# EAGLE design untitled (EAGLE 9.6.2)
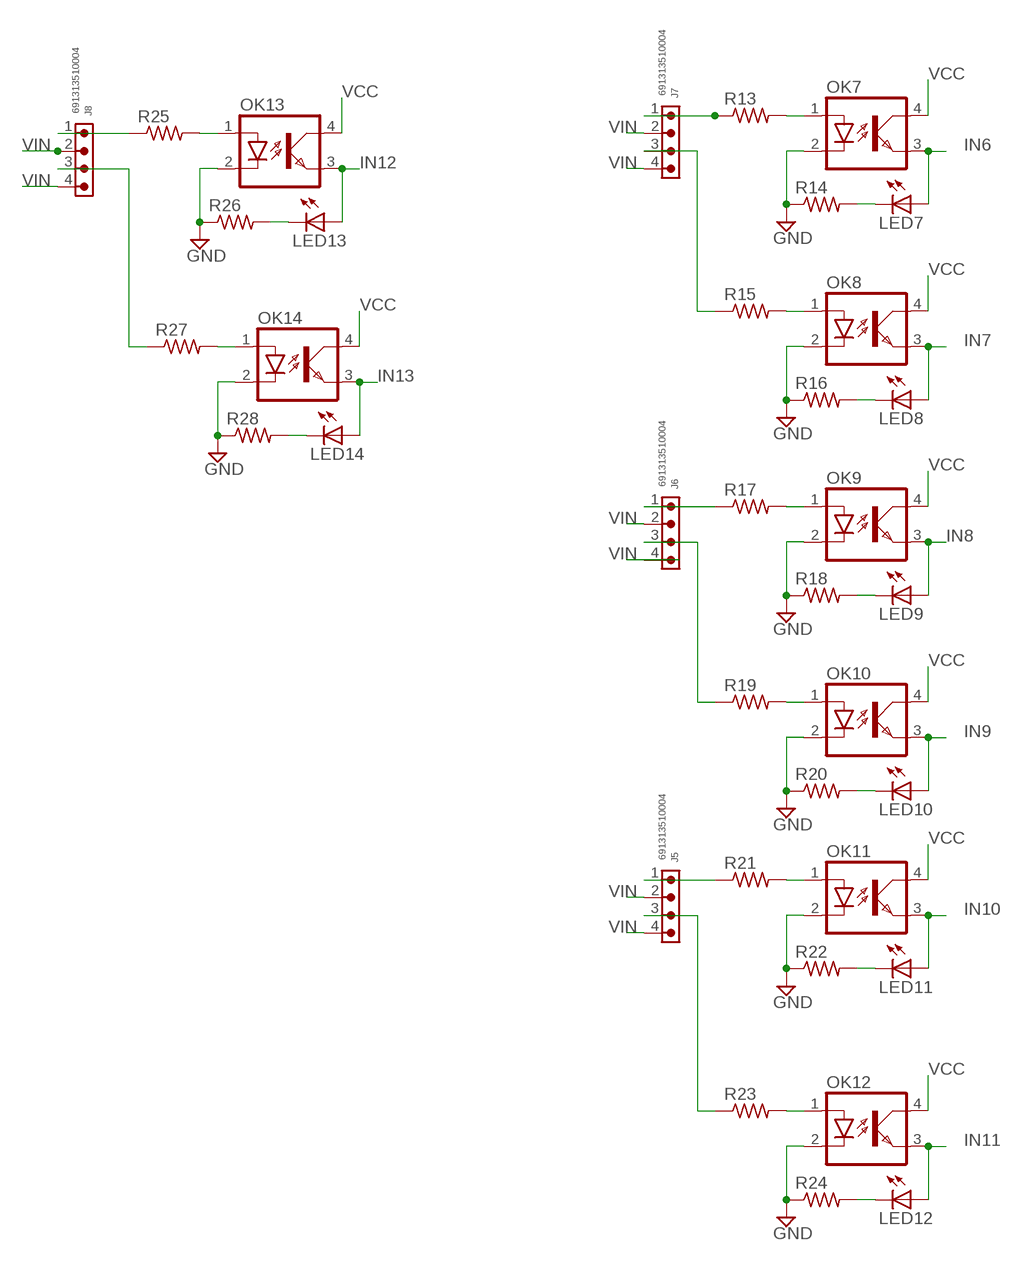
[diagram p0: schematic, sheet 1, part 1 of 2]
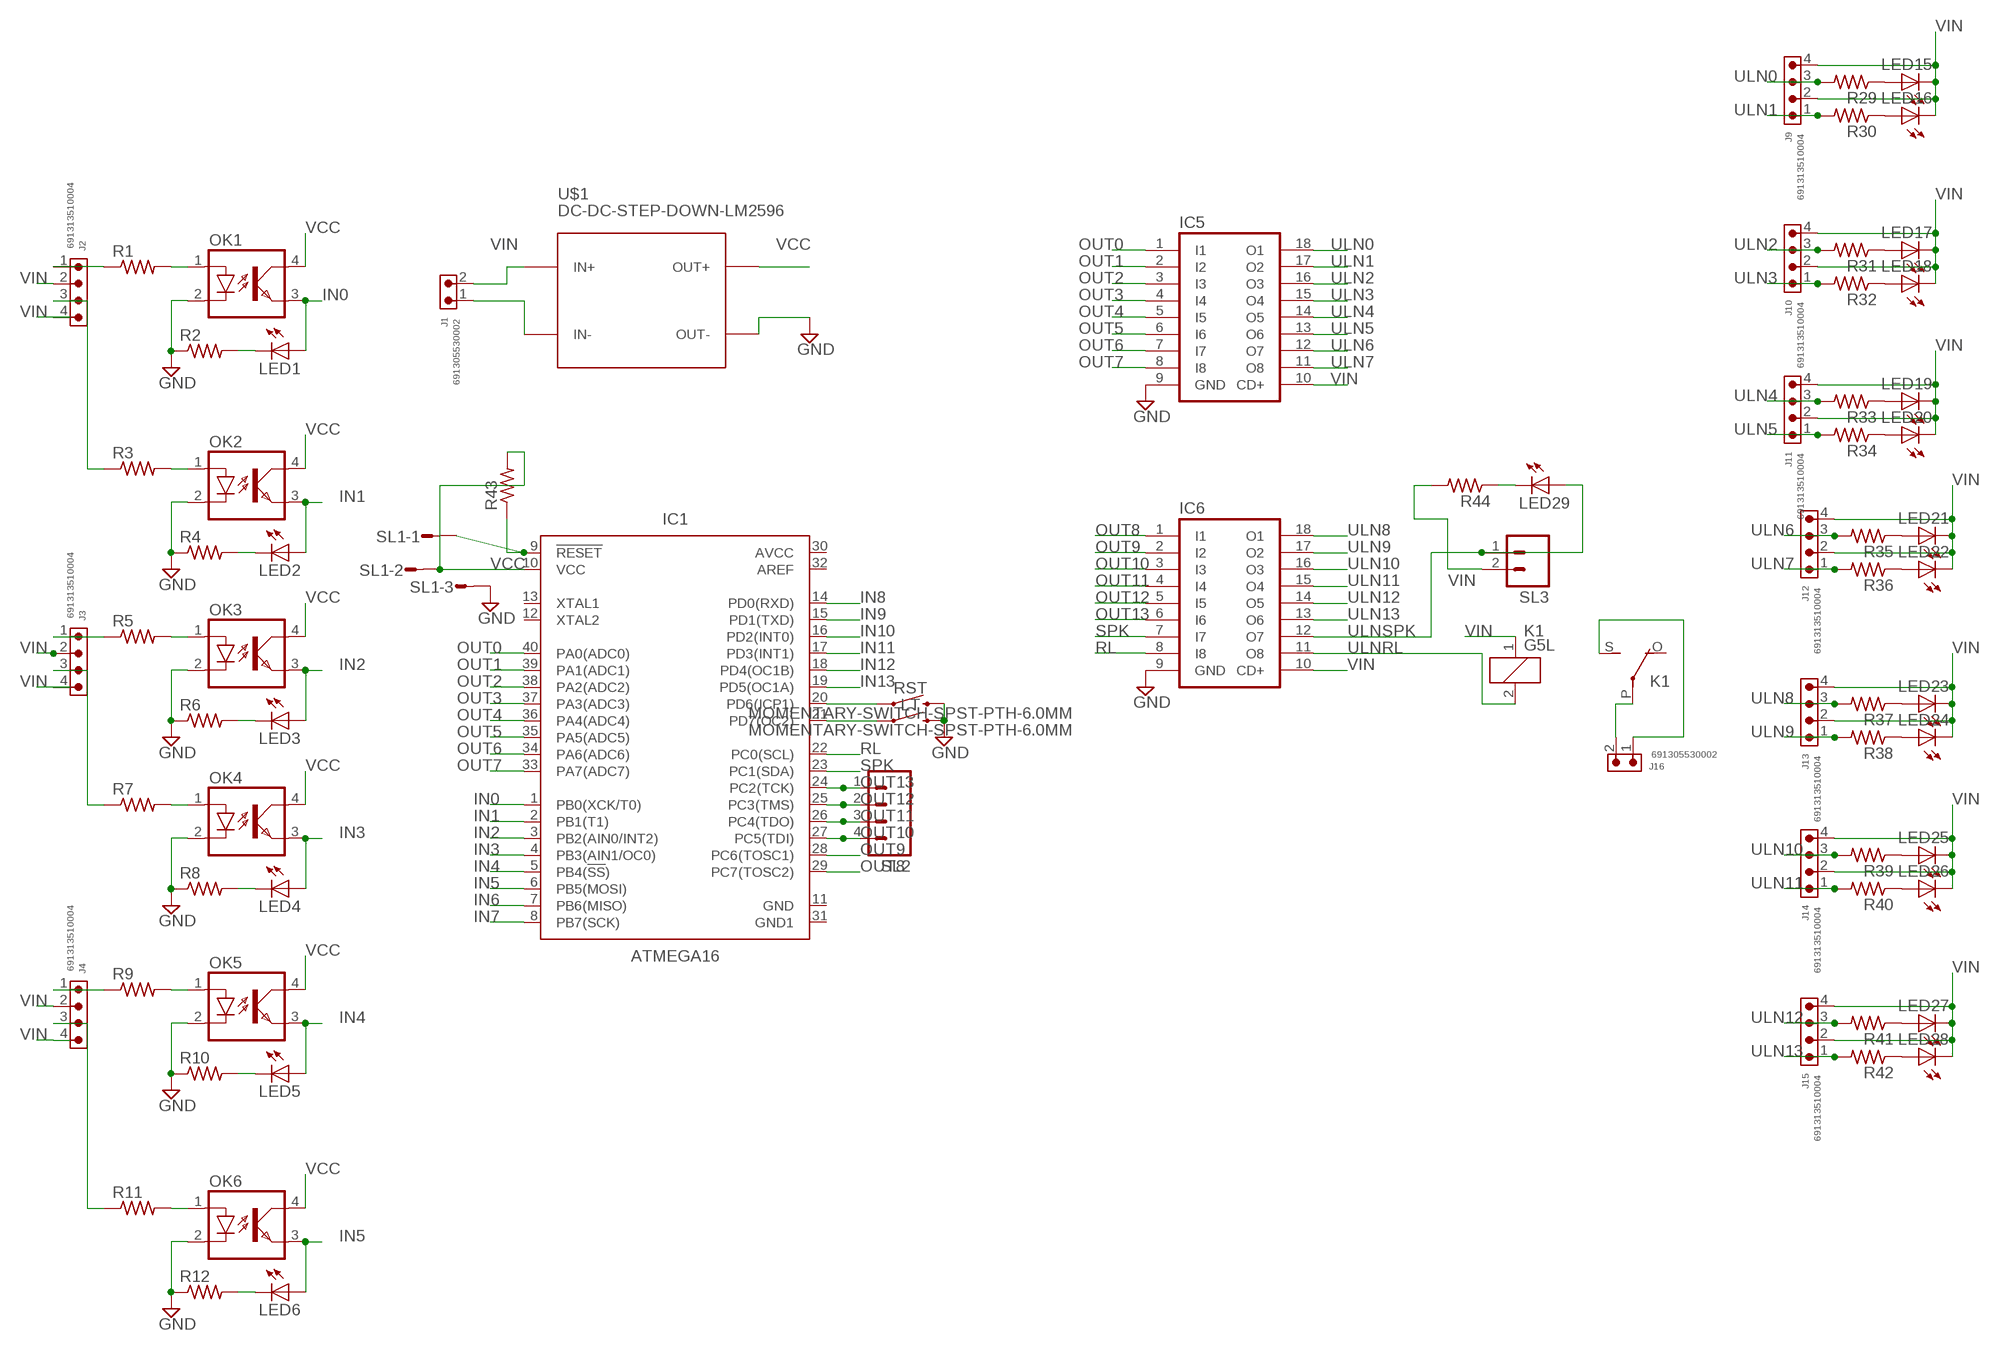
[diagram p1: schematic, sheet 1, part 2 of 2]

## Parts
IC1  ATMEGA16  ATMEGA32-16PU_DIP  [DIP1587W56P254L5229H482Q40B]
IC5  ULN2803A  [DIL18]
IC6  ULN2803A  [DIL18]
J1  691305530002  691305530002  [691305530002]
J2  691313510004  691313510004  [691313510004]
J3  691313510004  691313510004  [691313510004]
J4  691313510004  691313510004  [691313510004]
J5  691313510004  691313510004  [691313510004]
J6  691313510004  691313510004  [691313510004]
J7  691313510004  691313510004  [691313510004]
J8  691313510004  691313510004  [691313510004]
J9  691313510004  691313510004  [691313510004]
J10  691313510004  691313510004  [691313510004]
J11  691313510004  691313510004  [691313510004]
J12  691313510004  691313510004  [691313510004]
J13  691313510004  691313510004  [691313510004]
J14  691313510004  691313510004  [691313510004]
J15  691313510004  691313510004  [691313510004]
J16  691305530002  691305530002  [691305530002]
K1  G5L  [G5LE]
LED1  LED5MM  [LED5MM]
LED2  LED5MM  [LED5MM]
LED3  LED5MM  [LED5MM]
LED4  LED5MM  [LED5MM]
LED5  LED5MM  [LED5MM]
LED6  LED5MM  [LED5MM]
LED7  LED5MM  [LED5MM]
LED8  LED5MM  [LED5MM]
LED9  LED5MM  [LED5MM]
LED10  LED5MM  [LED5MM]
LED11  LED5MM  [LED5MM]
LED12  LED5MM  [LED5MM]
LED13  LED5MM  [LED5MM]
LED14  LED5MM  [LED5MM]
LED15  LED5MM  [LED5MM]
LED16  LED5MM  [LED5MM]
LED17  LED5MM  [LED5MM]
LED18  LED5MM  [LED5MM]
LED19  LED5MM  [LED5MM]
LED20  LED5MM  [LED5MM]
LED21  LED5MM  [LED5MM]
LED22  LED5MM  [LED5MM]
LED23  LED5MM  [LED5MM]
LED24  LED5MM  [LED5MM]
LED25  LED5MM  [LED5MM]
LED26  LED5MM  [LED5MM]
LED27  LED5MM  [LED5MM]
LED28  LED5MM  [LED5MM]
LED29  LED5MM  [LED5MM]
LT  MOMENTARY-SWITCH-SPST-PTH-6.0MM  [TACTILE_SWITCH_PTH_6.0MM]
OK1  PC817  [DIL04]
OK2  PC817  [DIL04]
OK3  PC817  [DIL04]
OK4  PC817  [DIL04]
OK5  PC817  [DIL04]
OK6  PC817  [DIL04]
OK7  PC817  [DIL04]
OK8  PC817  [DIL04]
OK9  PC817  [DIL04]
OK10  PC817  [DIL04]
OK11  PC817  [DIL04]
OK12  PC817  [DIL04]
OK13  PC817  [DIL04]
OK14  PC817  [DIL04]
R1  R-US_0207/7  [0207/7]
R2  R-US_0207/7  [0207/7]
R3  R-US_0207/7  [0207/7]
R4  R-US_0207/7  [0207/7]
R5  R-US_0207/7  [0207/7]
R6  R-US_0207/7  [0207/7]
R7  R-US_0207/7  [0207/7]
R8  R-US_0207/7  [0207/7]
R9  R-US_0207/7  [0207/7]
R10  R-US_0207/7  [0207/7]
R11  R-US_0207/7  [0207/7]
R12  R-US_0207/7  [0207/7]
R13  R-US_0207/7  [0207/7]
R14  R-US_0207/7  [0207/7]
R15  R-US_0207/7  [0207/7]
R16  R-US_0207/7  [0207/7]
R17  R-US_0207/7  [0207/7]
R18  R-US_0207/7  [0207/7]
R19  R-US_0207/7  [0207/7]
R20  R-US_0207/7  [0207/7]
R21  R-US_0207/7  [0207/7]
R22  R-US_0207/7  [0207/7]
R23  R-US_0207/7  [0207/7]
R24  R-US_0207/7  [0207/7]
R25  R-US_0207/7  [0207/7]
R26  R-US_0207/7  [0207/7]
R27  R-US_0207/7  [0207/7]
R28  R-US_0207/7  [0207/7]
R29  R-US_0207/7  [0207/7]
R30  R-US_0207/7  [0207/7]
R31  R-US_0207/7  [0207/7]
R32  R-US_0207/7  [0207/7]
R33  R-US_0207/7  [0207/7]
R34  R-US_0207/7  [0207/7]
R35  R-US_0207/7  [0207/7]
R36  R-US_0207/7  [0207/7]
R37  R-US_0207/7  [0207/7]
R38  R-US_0207/7  [0207/7]
R39  R-US_0207/7  [0207/7]
R40  R-US_0207/7  [0207/7]
R41  R-US_0207/7  [0207/7]
R42  R-US_0207/7  [0207/7]
R43  R-US_0207/7  [0207/7]
R44  R-US_0207/7  [0207/7]
RST  MOMENTARY-SWITCH-SPST-PTH-6.0MM  [TACTILE_SWITCH_PTH_6.0MM]
SL1  M03S  [03P]
SL2  M04  [04P]
SL3  M02  [02P]
U$1  DC-DC-STEP-DOWN-LM2596  [DC-DC-STEP-DOWN-LM2596]

## Nets
GND: IC5.9(GND) IC6.9(GND) LT.3 OK1.2(C) OK2.2(C) OK3.2(C) OK4.2(C) OK5.2(C) OK6.2(C) OK7.2(C) OK8.2(C) OK9.2(C) OK10.2(C) OK11.2(C) OK12.2(C) OK13.2(C) OK14.2(C) R2.1 R4.1 R6.1 R8.1 R10.1 R12.1 R14.1 R16.1 R18.1 R20.1 R22.1 R24.1 R26.1 R28.1 RST.3 SL1.3 U$1.OUT-
IN0: IC1.1(PB0(XCK/T0)) LED1.A OK1.3(EMIT)
IN1: IC1.2(PB1(T1)) LED2.A OK2.3(EMIT)
IN2: IC1.3(PB2(AIN0/INT2)) LED3.A OK3.3(EMIT)
IN3: IC1.4(PB3(AIN1/OC0)) LED4.A OK4.3(EMIT)
IN4: IC1.5(PB4(!SS!)) LED5.A OK5.3(EMIT)
IN5: IC1.6(PB5(MOSI)) LED6.A OK6.3(EMIT)
IN6: IC1.7(PB6(MISO)) LED7.A OK7.3(EMIT)
IN7: IC1.8(PB7(SCK)) LED8.A OK8.3(EMIT)
IN8: IC1.14(PD0(RXD)) LED9.A OK9.3(EMIT)
IN9: IC1.15(PD1(TXD)) LED10.A OK10.3(EMIT)
IN10: IC1.16(PD2(INT0)) LED11.A OK11.3(EMIT)
IN11: IC1.17(PD3(INT1)) LED12.A OK12.3(EMIT)
IN12: IC1.18(PD4(OC1B)) LED13.A OK13.3(EMIT)
IN13: IC1.19(PD5(OC1A)) LED14.A OK14.3(EMIT)
N$2: J2.1 R1.1
N$3: OK1.1(A) R1.2
N$5: IC1.9(!RESET!) R43.1 SL1.1
N$6: LED1.K(C) R2.2
N$7: J2.3 R3.1
N$8: OK2.1(A) R3.2
N$10: LED17.A R31.1
N$11: LED2.K(C) R4.2
N$12: J3.1 R5.1
N$13: OK3.1(A) R5.2
N$15: LED18.A R32.1
N$16: LED3.K(C) R6.2
N$17: J3.3 R7.1
N$18: OK4.1(A) R7.2
N$20: LED15.A R29.1
N$21: LED4.K(C) R8.2
N$22: J4.1 R9.1
N$23: OK5.1(A) R9.2
N$24: J1.1 U$1.IN-
N$25: LED19.A R33.1
N$26: LED5.K(C) R10.2
N$27: J4.3 R11.1
N$28: OK6.1(A) R11.2
N$30: LED16.A R30.1
N$31: LED6.K(C) R12.2
N$32: J7.1 R13.1
N$33: OK7.1(A) R13.2
N$35: LED20.A R34.1
N$36: LED7.K(C) R14.2
N$37: J7.3 R15.1
N$38: OK8.1(A) R15.2
N$40: LED21.A R35.1
N$41: LED8.K(C) R16.2
N$42: J6.1 R17.1
N$43: OK9.1(A) R17.2
N$45: LED22.A R36.1
N$46: LED9.K(C) R18.2
N$47: J6.3 R19.1
N$48: OK10.1(A) R19.2
N$50: LED23.A R37.1
N$51: LED10.K(C) R20.2
N$52: J5.1 R21.1
N$53: OK11.1(A) R21.2
N$55: LED24.A R38.1
N$56: LED11.K(C) R22.2
N$57: J5.3 R23.1
N$58: OK12.1(A) R23.2
N$60: LED25.A R39.1
N$61: LED12.K(C) R24.2
N$62: J8.1 R25.1
N$63: OK13.1(A) R25.2
N$65: LED26.A R40.1
N$66: LED13.K(C) R26.2
N$67: J8.3 R27.1
N$68: OK14.1(A) R27.2
N$70: LED27.A R41.1
N$71: LED14.K(C) R28.2
N$72: LED28.A R42.1
N$73: IC1.20(PD6(ICP1)) RST.1
N$74: IC1.21(PD7(OC2)) LT.1
N$75: J16.2 K1.P(2:P)
N$76: J16.1 K1.S(2:S)
N$77: LED29.K(C) R44.1
OUT0: IC1.40(PA0(ADC0)) IC5.1(I1)
OUT1: IC1.39(PA1(ADC1)) IC5.2(I2)
OUT2: IC1.38(PA2(ADC2)) IC5.3(I3)
OUT3: IC1.37(PA3(ADC3)) IC5.4(I4)
OUT4: IC1.36(PA4(ADC4)) IC5.5(I5)
OUT5: IC1.35(PA5(ADC5)) IC5.6(I6)
OUT6: IC1.34(PA6(ADC6)) IC5.7(I7)
OUT7: IC1.33(PA7(ADC7)) IC5.8(I8)
OUT8: IC1.29(PC7(TOSC2)) IC6.1(I1)
OUT9: IC1.28(PC6(TOSC1)) IC6.2(I2)
OUT10: IC1.27(PC5(TDI)) IC6.3(I3) SL2.4
OUT11: IC1.26(PC4(TDO)) IC6.4(I4) SL2.3
OUT12: IC1.25(PC3(TMS)) IC6.5(I5) SL2.2
OUT13: IC1.24(PC2(TCK)) IC6.6(I6) SL2.1
RL: IC1.22(PC0(SCL)) IC6.8(I8)
SPK: IC1.23(PC1(SDA)) IC6.7(I7)
ULN0: IC5.18(O1) J9.3 R29.2
ULN1: IC5.17(O2) J9.1 R30.2
ULN2: IC5.16(O3) J10.3 R31.2
ULN3: IC5.15(O4) J10.1 R32.2
ULN4: IC5.14(O5) J11.3 R33.2
ULN5: IC5.13(O6) J11.1 R34.2
ULN6: IC5.12(O7) J12.3 R35.2
ULN7: IC5.11(O8) J12.1 R36.2
ULN8: IC6.18(O1) J13.3 R37.2
ULN9: IC6.17(O2) J13.1 R38.2
ULN10: IC6.16(O3) J14.3 R39.2
ULN11: IC6.15(O4) J14.1 R40.2
ULN12: IC6.14(O5) J15.3 R41.2
ULN13: IC6.13(O6) J15.1 R42.2
ULNRL: IC6.11(O8) K1.2
ULNSPK: IC6.12(O7) LED29.A SL3.1
VCC: IC1.10(VCC) OK1.4(COL) OK2.4(COL) OK3.4(COL) OK4.4(COL) OK5.4(COL) OK6.4(COL) OK7.4(COL) OK8.4(COL) OK9.4(COL) OK10.4(COL) OK11.4(COL) OK12.4(COL) OK13.4(COL) OK14.4(COL) R43.2 SL1.2 U$1.OUT+
VIN: IC5.10(CD+) IC6.10(CD+) J1.2 J2.2 J2.4 J3.2 J3.4 J4.2 J4.4 J5.2 J5.4 J6.2 J6.4 J7.2 J7.4 J8.2 J8.4 J9.2 J9.4 J10.2 J10.4 J11.2 J11.4 J12.2 J12.4 J13.2 J13.4 J14.2 J14.4 J15.2 J15.4 K1.1 LED15.K(C) LED16.K(C) LED17.K(C) LED18.K(C) LED19.K(C) LED20.K(C) LED21.K(C) LED22.K(C) LED23.K(C) LED24.K(C) LED25.K(C) LED26.K(C) LED27.K(C) LED28.K(C) R44.2 SL3.2 U$1.IN+
Unconnected: IC1.12(XTAL2) IC1.13(XTAL1) IC1.32(AREF) K1.O(2:O)

## Power pins joined to a net without a drawn wire
AVCC: IC1.30(AVCC)
GND: IC1.11(GND)
GND1: IC1.31(GND1)

## Library data of the parts
IC1 = IC_Embedded:ATMEGA32*DIP: 8-bit Microcontroller with 32KBytes In-System Programmable Flash Datasheet <http://ww1.microchip.com/downloads/en/DeviceDoc/doc2503.pdf>; CATEGORY: IC_Embedded; DESCRIPTION: IC MCU 8BIT 32KB FLASH 40DIP; MANUFACTURER: Microchip Technology; MPN: ATMEGA32-16PU; OPERATING_TEMP: -40°C to 85°C; PART_STATUS: Active; SERIES: AVR® ATmega; SPEED: 16MHz; SUB-CATEGORY: Microcontroller
IC5 IC6 = uln-udn:ULN2803A: DRIVER ARRAY
J1 J16 = Wurth_Connectors_WR-TBL Pluggable Connector:691305530002: WR-TBL Serie 3055 - 5,08 mm - PCB Header Vertical Entry with Plastic Latches KIND PROPERTIES Pitch 5.08 mm MATERIAL PROPERTIES Insulator Material PA66 Insulator Flammability Rating UL94 V-0 Insulator Color Green Terminal Material Copper Alloy Terminal Plating Tin-plated surface GENERAL INFORMATION Operating Temperature -40 up to +105 °C ELECTRICAL PROPERTIES IR UL 16 A Working Voltage [UL] 300 V (AC) Withstanding Voltage [UL] 2500 V (AC) Contact Resistance [UL] 20 mΩ CERTIFICATION UL Approval E315414 <https://www.we-online.com/catalog/media/o135349v209%20Family_WR-TBL3_6913055300xx.jpg> Details see: https://www.we-online.com/catalog/en/TBL_5_08_3055_6913055300XX/ Updated by Ella Wu 2019-12-30 2019(C) Wurth Elektronik; DATASHEET-URL: https://www.we-online.com/catalog/datasheet/691305530002.pdf; IR-UL: 16A; MOUNT: THT; PART-NUMBER: 691305530002; PINS: 2; PITCH: 5.08mm; TYPE: Vertical; WORKING-VOLTAGE-UL: 300V (AC)
J2-J15 = Wurth_Connectors_WR-TBL Pluggable Connector:691313510004: WR-TBL Serie 313 - 5.08 mm Close Horizontal PCB Header KIND PROPERTIES Pitch 5.08 mm MATERIAL PROPERTIES Insulator Material PA66 Insulator Flammability Rating UL94 V-0 Insulator Color Green Contact Material Brass Contact Plating Tin GENERAL INFORMATION Operating Temperature -40 up to +105 °C ELECTRICAL PROPERTIES IR cULus 20 A IR VDE 20 A Working Voltage [cULus] 300 V (AC) Working Voltage [VDE] 300 V (AC) Withstanding Voltage [cULus] 1600 V (AC) Withstanding Voltage [VDE] 2500 V (AC) Contact Resistance [cULus] 20 mΩ Contact Resistance [VDE] 20 mΩ CERTIFICATION cULus Approval E315414 VDE Approval 40023195 [Model number 313] <https://www.we-online.com/catalog/media/o33265v209%20Family_WR-TBL_6913135100xx.jpg> https://www.we-online.com/catalog/en/TBL_5_08_313_CLOSE_HORIZONTAL_PCB_HEADER_6913135100XX/ Updated by Ella Wu 2019-12-26 2019(C) Wurth Elektronik; DATASHEET-URL: https://www.we-online.com/catalog/datasheet/691313510004.pdf; IR-UL: 20A; IR-VDE: 20A; MOUNT: THT; PART-NUMBER: 691313510004; PINS: 4; PITCH: 5.08mm; TYPE: Horizontal; WORKING-VOLTAGE-UL: 300V (AC); WORKING-VOLTAGE-VDE: 300V (AC)
K1 = relay:G5L: RELAY 1 x switch, 10 A/120 V AC, 8 A/30 V ADC, Omron; OC_FARNELL: unknown; OC_NEWARK: unknown
LED1-LED29 = adafruit:LED: LED OSRAM: - CHIPLED LG R971, LG N971, LY N971, LG Q971, LY Q971, LO R971, LY R971 LH N974, LH R974 LS Q976, LO Q976, LY Q976 LO Q996 - Hyper CHIPLED LW Q18S LB Q993, LB Q99A, LB R99A - SideLED LS A670, LO A670, LY A670, LG A670, LP A670 LB A673, LV A673, LT A673, LW A673 LH A674 LY A675 LS A676, LA A676, LO A676, LY A676, LW A676 LS A679, LY A679, LG A679 - Hyper Micro SIDELED® LS Y876, LA Y876, LO Y876, LY Y876 LT Y87S - SmartLED LW L88C, LW L88S LB L89C, LB L89S, LG L890 LS L89K, LO L89K, LY L89K LS L896, LA L896, LO L896, LY L896 - TOPLED LS T670, LO T670, LY T670, LG T670, LP T670 LSG T670, LSP T670, LSY T670, LOP T670, LYG T670 LG T671, LOG T671, LSG T671 LB T673, LV T673, LT T673, LW T673 LH T674 LS T676, LA T676, LO T676, LY T676, LB T676, LH T676, LSB T676, LW T676 LB T67C, LV T67C, LT T67C, LS T67K, LO T67K, LY T67K, LW E67C LS E67B, LA E67B, LO E67B, LY E67B, LB E67C, LV E67C, LT E67C LW T67C LS T679, LY T679, LG T679 LS T770, LO T770, LY T770, LG T770, LP T770 LB T773, LV T773, LT T773, LW T773 LH T774 LS E675, LA E675, LY E675, LS T675 LS T776, LA T776, LO T776, LY T776, LB T776 LHGB T686 LT T68C, LB T68C - Hyper Mini TOPLED® LB M676 - Mini TOPLED Santana® LG M470 LS M47K, LO M47K, LY M47K Source: http://www.osram.convergy.de/
LT RST = SparkFun-Switches:MOMENTARY-SWITCH-SPST: Momentary Switch (Pushbutton) - SPST Normally-open (NO) SPST momentary switches (buttons, pushbuttons). Variants PTH-12MM - 12mm square, through-hole Momentary Pushbutton Switch - 12mm Square <https://www.sparkfun.com/products/9190> (COM-09190) PTH-6.0MM, PTH-6.0MM-KIT - 6.0mm square, through-hole Mini Pushbutton Switch <https://www.sparkfun.com/products/97> (COM-00097) KIT package intended for soldering kit's - only one side of pads' copper is exposed. PTH-RIGHT-ANGLE-KIT - Right-angle, through-hole Right Angle Tactile Button <https://www.sparkfun.com/products/10791> - Used on SparkFun BigTime Watch Kit <https://www.sparkfun.com/products/11734> SMD-12MM - 12mm square, surface-mount Tactile Button - SMD (12mm) <https://www.sparkfun.com/products/12993> (COM-12993) Used on SparkFun PicoBoard <https://www.sparkfun.com/products/11888> SMD-4.5MM - 4.5mm Square Trackball Switch Used on SparkFun Blackberry Trackballer Breakout <https://www.sparkfun.com/products/13169> SMD-4.6MMX2.8MM - 4.60mm x 2.80mm, surface mount Used on SparkFun SAMD21 Mini Breakout <https://www.sparkfun.com/products/13664> SMD-5.2MM, SMD-5.2-REDUNDANT - 5.2mm square, surface-mount Mini Pushbutton Switch - SMD <https://www.sparkfun.com/products/8720> (COM-08720) Used on Arduino Pro Mini <https://www.sparkfun.com/products/11114> REDUNDANT package connects both switch circuits together SMD-6.0X3.5MM - 6.0 x 3.5mm, surface mount Momentary Reset Switch SMD <https://www.sparkfun.com/products/8229> (COM-08229) SMD-6.2MM-TALL - 6.2mm square, surface mount Tactile Button - SMD (6mm) <https://www.sparkfun.com/products/12992> Used on SparkFun Digital Sandbox <https://www.sparkfun.com/products/12651> SMD-RIGHT-ANGLE - Right-angle, surface mount Used on SparkFun Block for Intel® Edison - Arduino <https://www.sparkfun.com/products/13036>; PROD_ID: SWCH-08441; SF_SKU: COM-00097
OK1-OK14 = optocoupler:PC817: SHARP OPTO COUPLER; MPN: PC817X4J000F; OC_FARNELL: 9707727; OC_NEWARK: 97K7059
R1-R44 = adafruit:R-US_: RESISTOR, American symbol
SL1 = con-amp-quick:M03S: AMP QUICK CONNECTOR; OC_FARNELL: unknown; OC_NEWARK: unknown
SL2 = con-amp-quick:M04: AMP QUICK CONNECTOR; OC_FARNELL: unknown; OC_NEWARK: unknown
SL3 = con-amp-quick:M02: AMP QUICK CONNECTOR; OC_FARNELL: unknown; OC_NEWARK: unknown
U$1 = diy-modules:DC-DC-STEP-DOWN-LM2596: DC/DC Step-Down Regulator based on LM2596-ADJ chip LM2596 datasheet available here: http://www.ti.com/lit/ds/symlink/lm2596.pdf Click here to find device on ebay.com <http://www.ebay.com/sch/lm2596+power+regulator>

## Board
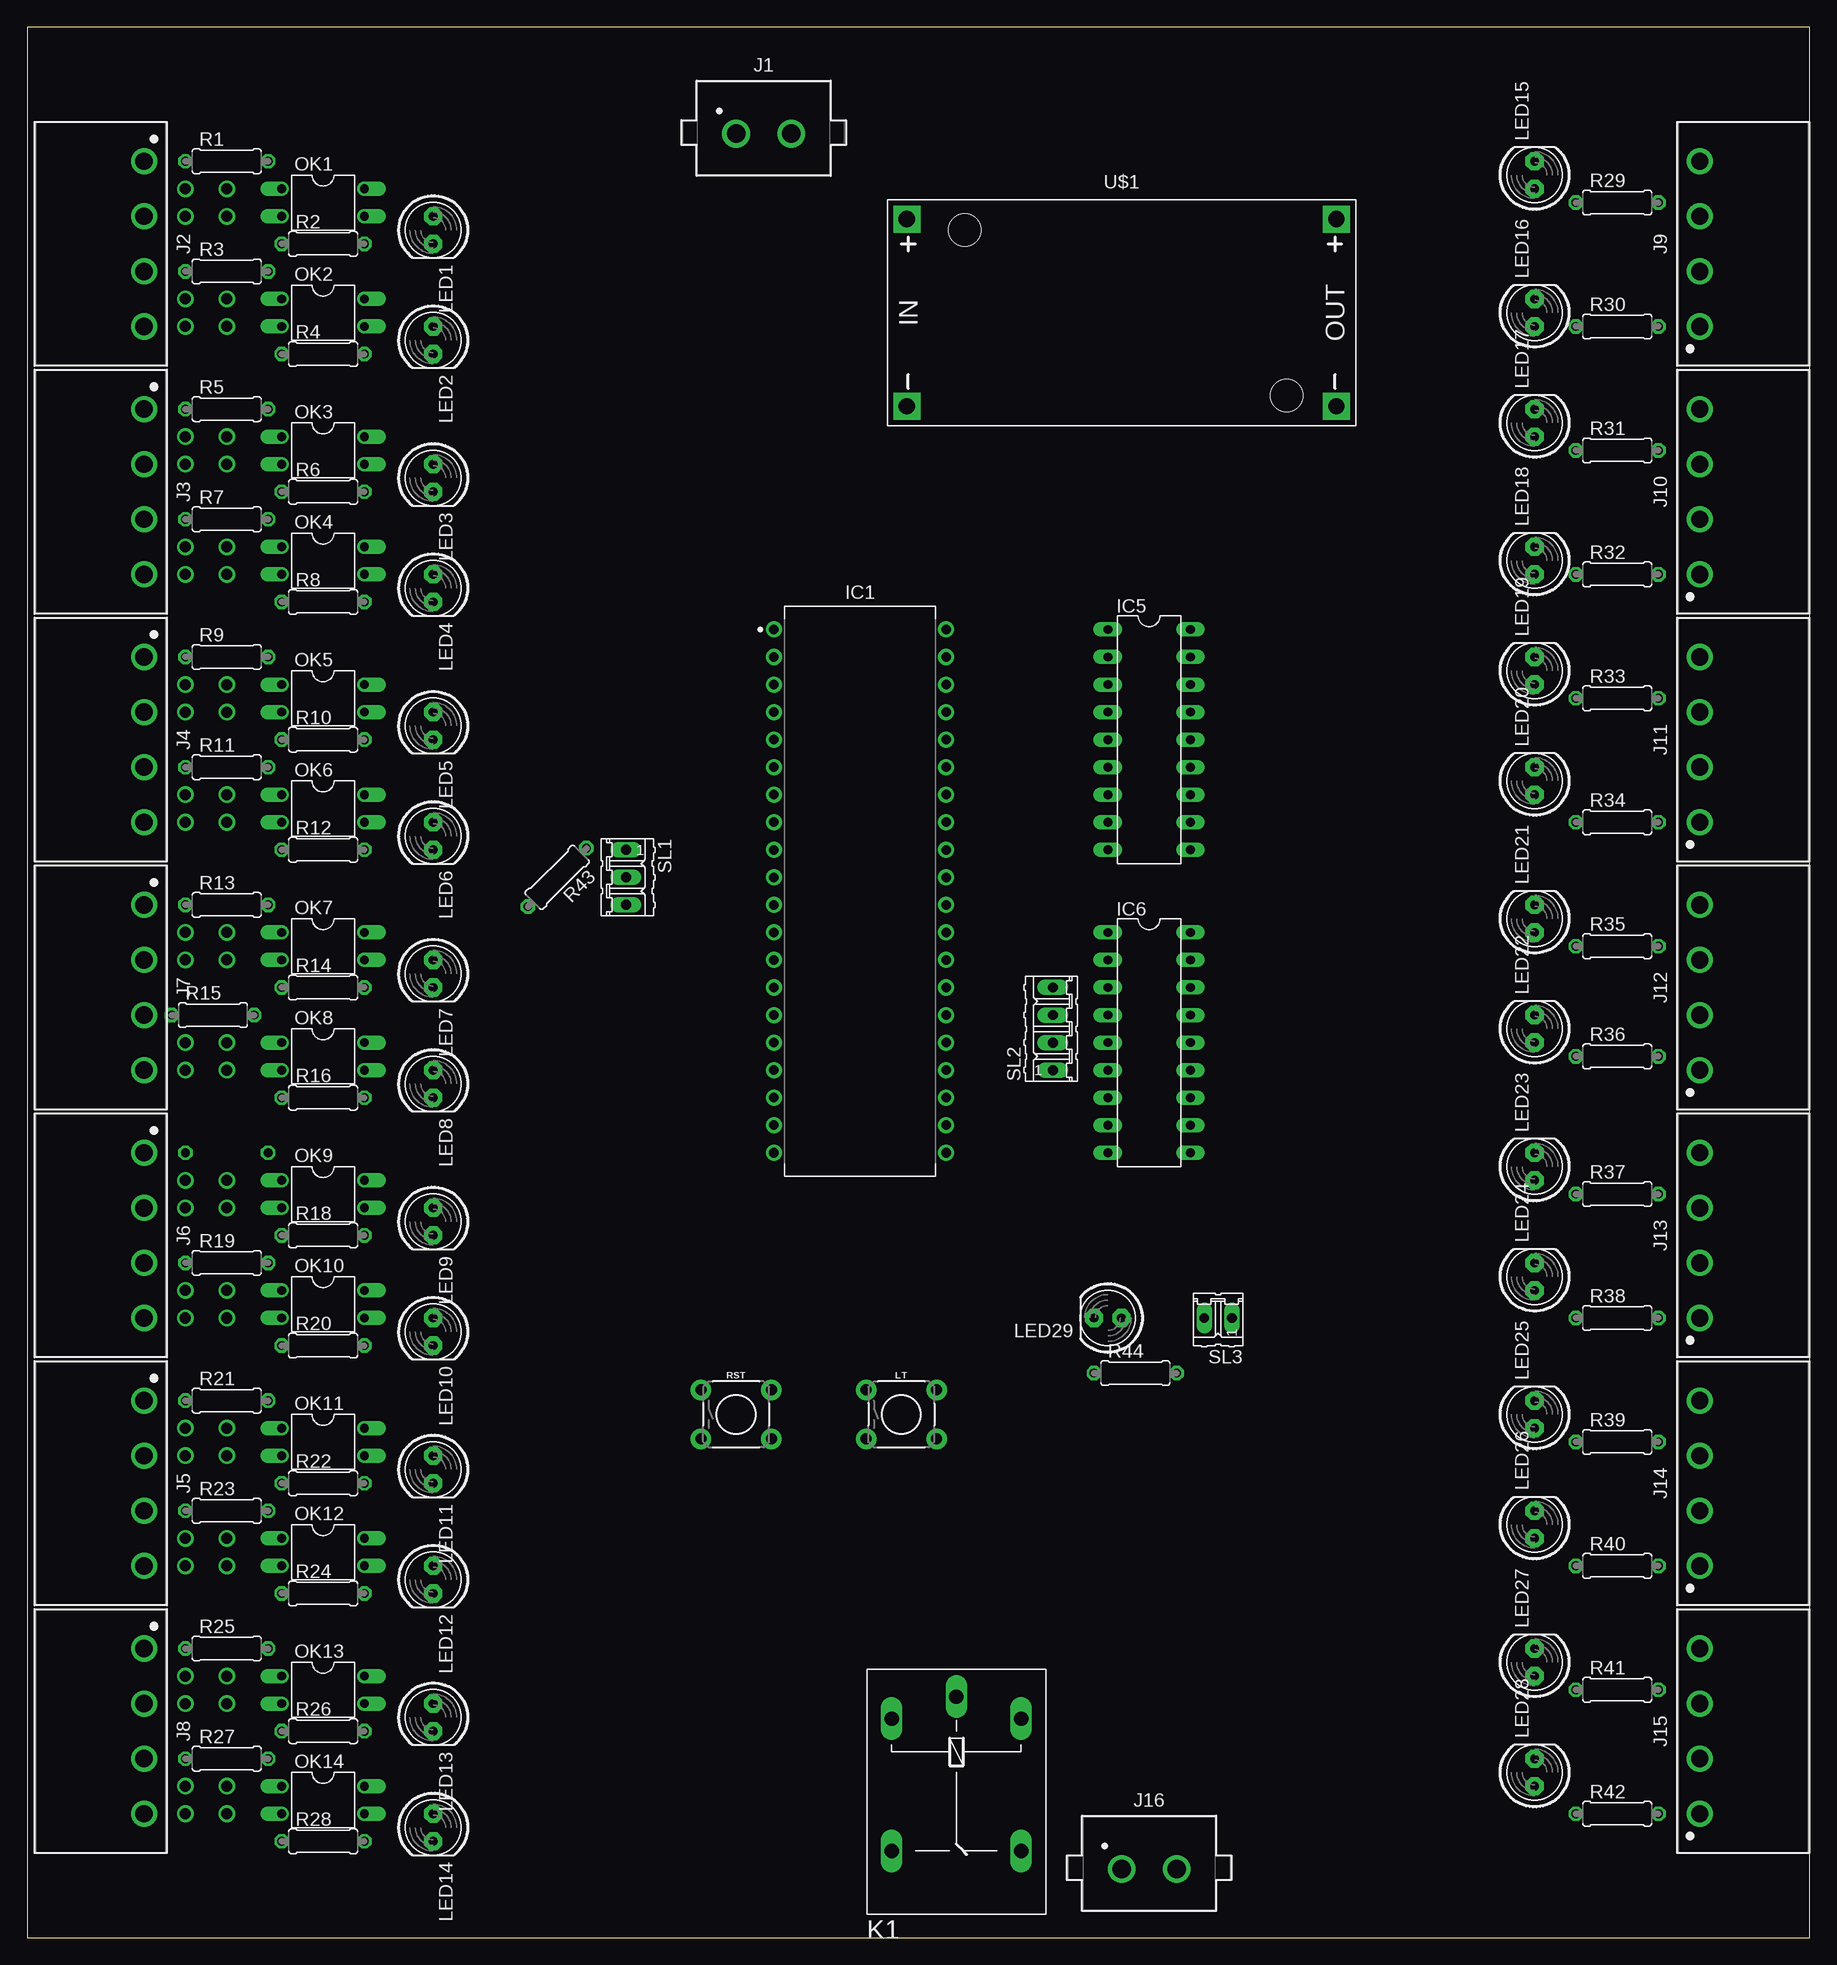
[diagram p2: board, top side]
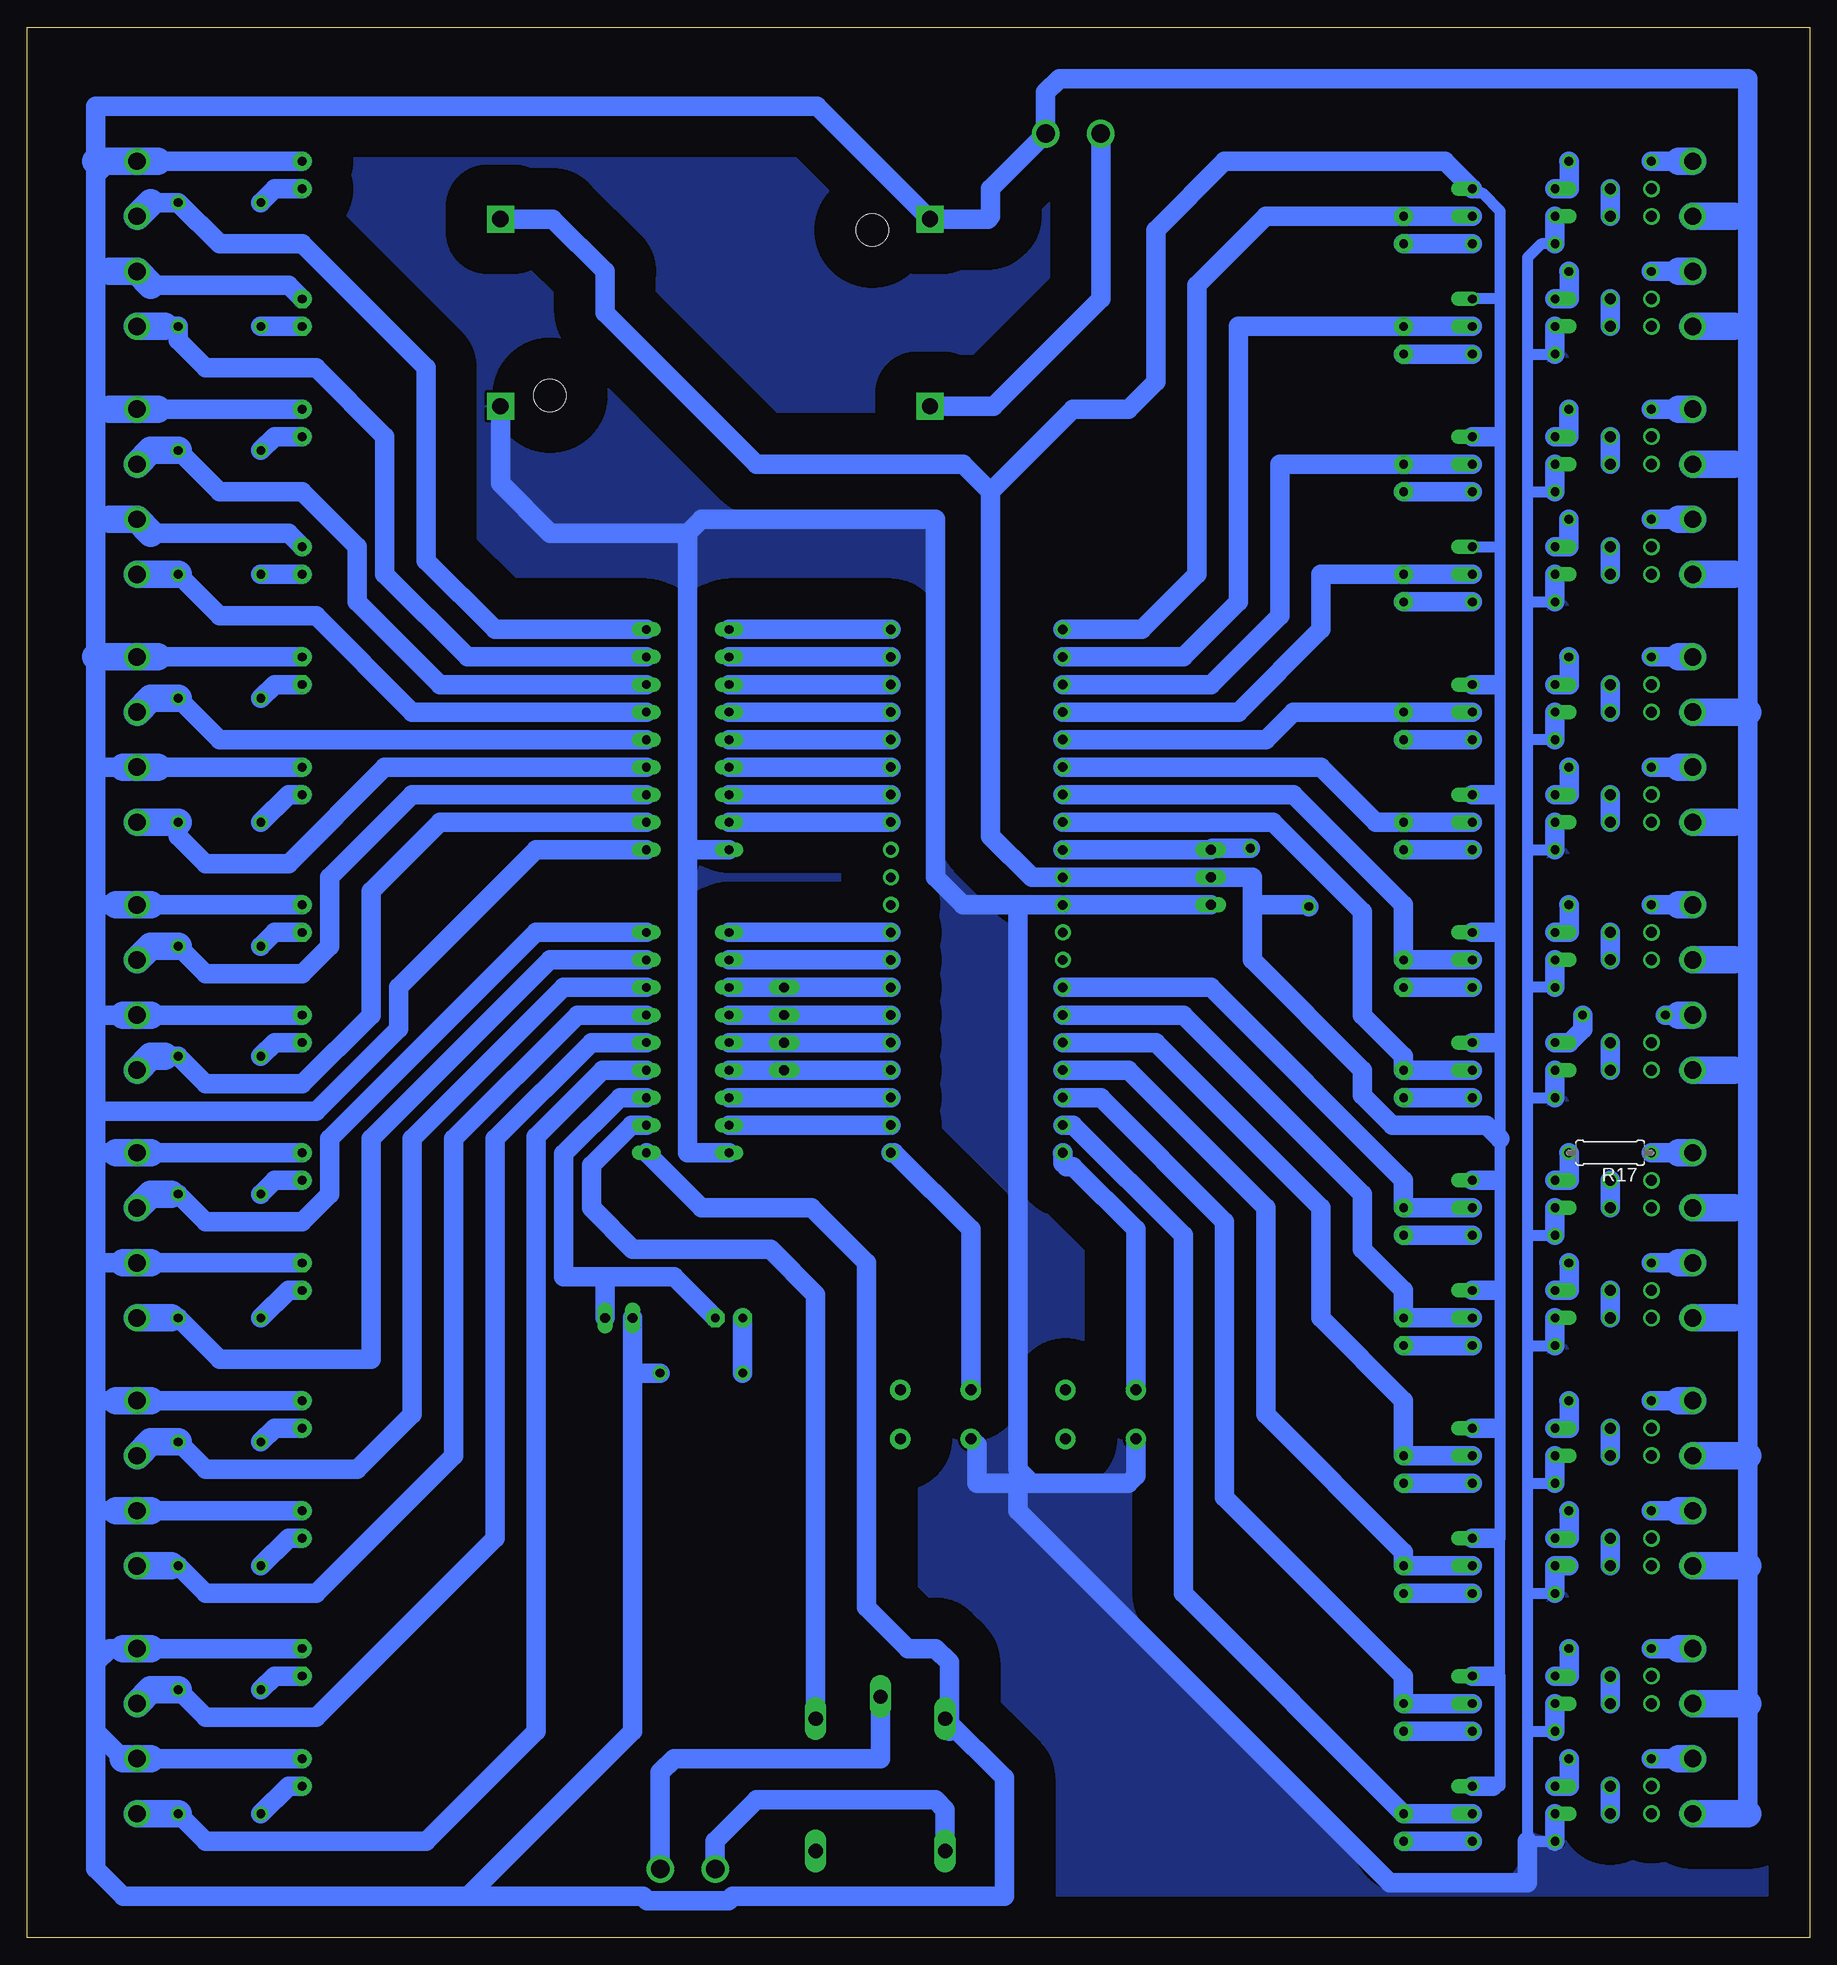
[diagram p3: board, bottom side, seen from below]

Size 164.44 x 176.2 mm. Coordinates in mm from the lower left corner, seen from the top.
Outline: 0,0 164.44,0 164.44,176.2 0,176.2 0,0
Copper layers (1*16): Top 0.035mm / dielectric 1.5mm / Bottom 0.035mm
Design rules "default *": minimum track width 70mil, minimum drill 0.35mm, track to track 30mil, track to pad 30mil, pad to pad 30mil, via to via 30mil, smd to smd 6mil, copper to edge 40mil, drill to drill 6mil, minimum pad ring 10mil, minimum via ring 8mil, stop-mask expansion 4mil, vias tented up to drill 0mil, thermal gap 10mil

### Footprints (pad centres in the part's own frame; a part is rotated, then mirrored left to right if it is on the bottom)
DIP1587W56P254L5229H482Q40B = drill 0.877 pad 1.477: 1 -7.938,24.13; 2 -7.938,21.59; 3 -7.938,19.05; 4 -7.938,16.51; 5 -7.938,13.97; 6 -7.938,11.43; 7 -7.938,8.89; 8 -7.938,6.35; 9 -7.938,3.81; 10 -7.938,1.27; 11 -7.938,-1.27; 12 -7.938,-3.81; 13 -7.938,-6.35; 14 -7.938,-8.89; 15 -7.938,-11.43; 16 -7.938,-13.97; 17 -7.938,-16.51; 18 -7.938,-19.05; 19 -7.938,-21.59; 20 -7.938,-24.13; 21 7.938,-24.13; 22 7.938,-21.59; 23 7.938,-19.05; 24 7.938,-16.51; 25 7.938,-13.97; 26 7.938,-11.43; 27 7.938,-8.89; 28 7.938,-6.35; 29 7.938,-3.81; 30 7.938,-1.27; 31 7.938,1.27; 32 7.938,3.81; 33 7.938,6.35; 34 7.938,8.89; 35 7.938,11.43; 36 7.938,13.97; 37 7.938,16.51; 38 7.938,19.05; 39 7.938,21.59; 40 7.938,24.13
DIL18 = drill 0.813 long: 1 -10.16,-3.81; 2 -7.62,-3.81; 3 -5.08,-3.81; 4 -2.54,-3.81; 5 0,-3.81; 6 2.54,-3.81; 7 5.08,-3.81; 8 7.62,-3.81; 9 10.16,-3.81; 10 10.16,3.81; 11 7.62,3.81; 12 5.08,3.81; 13 2.54,3.81; 14 0,3.81; 15 -2.54,3.81; 16 -5.08,3.81; 17 -7.62,3.81; 18 -10.16,3.81
691305530002 = drill 1.7: 1 -2.54,0; 2 2.54,0
691313510004 = drill 1.6: 1 -7.62,0; 2 -2.54,0; 3 2.54,0; 4 7.62,0
G5LE = drill 1.321 long: 1 -7.493,-5.969; 2 -7.493,5.969; O 4.699,5.969; P -9.525,0; S 4.699,-5.969
LED5MM = drill 0.813 pad 1.676 octagon: A -1.27,0; K 1.27,0
TACTILE_SWITCH_PTH_6.0MM = drill 1.016 pad 1.88: 1 -3.251,2.261; 2 3.251,2.261; 3 -3.251,-2.261; 4 3.251,-2.261
DIL04 = drill 0.813 offset: 1 -1.27,-3.81; 2 1.27,-3.81; 3 1.27,3.81; 4 -1.27,3.81
0207/7 = drill 0.813 octagon: 1 -3.81,0; 2 3.81,0
03P = drill 0.914 long: 1 -2.54,0; 2 0,0; 3 2.54,0
04P = drill 0.914 long: 1 -3.81,0; 2 -1.27,0; 3 1.27,0; 4 3.81,0
02P = drill 0.914 long: 1 -1.27,0; 2 1.27,0
DC-DC-STEP-DOWN-LM2596 = drill 1.5 pad 2.5 square: IN+ -19.812,8.636; IN- -19.812,-8.636; OUT+ 19.812,8.636; OUT- 19.812,-8.636 | hole 3: -14.478,7.62; 15.24,-7.62

### Placement (x,y rotation side)
IC1  76.84,96.52 0 top
IC5  103.5,110.49 270 top
IC6  103.5,82.55 270 top
J1  67.94,166.37 0 top
J2  10.79,156.21 270 top
J3  10.79,133.35 270 top
J4  10.79,110.49 270 top
J5  10.79,41.91 270 top
J6  10.79,64.77 270 top
J7  10.79,87.63 270 top
J8  10.79,19.05 270 top
J9  154.31,156.21 90 top
J10  154.31,133.35 90 top
J11  154.31,110.49 90 top
J12  154.31,87.63 90 top
J13  154.31,64.77 90 top
J14  154.31,41.91 90 top
J15  154.31,19.05 90 top
J16  103.5,6.35 0 top
K1  85.72,12.7 270 top
LED1  37.47,157.48 270 top
LED2  37.47,147.32 270 top
LED3  37.47,134.62 270 top
LED4  37.47,124.46 270 top
LED5  37.47,111.76 270 top
LED6  37.47,101.6 270 top
LED7  37.47,88.9 270 top
LED8  37.47,78.74 270 top
LED9  37.47,66.04 270 top
LED10  37.47,55.88 270 top
LED11  37.47,43.18 270 top
LED12  37.47,33.02 270 top
LED13  37.47,20.32 270 top
LED14  37.47,10.16 270 top
LED15  139.06,162.56 90 top
LED16  139.06,149.86 90 top
LED17  139.06,139.7 90 top
LED18  139.06,127 90 top
LED19  139.06,116.84 90 top
LED20  139.06,106.68 90 top
LED21  139.06,93.98 90 top
LED22  139.06,83.82 90 top
LED23  139.06,71.12 90 top
LED24  139.06,60.96 90 top
LED25  139.06,48.26 90 top
LED26  139.06,38.1 90 top
LED27  139.06,25.4 90 top
LED28  139.06,15.24 90 top
LED29  99.69,57.15 180 top
LT  80.65,48.26 0 top
OK1  27.3,160.02 270 top
OK2  27.3,149.86 270 top
OK3  27.3,137.16 270 top
OK4  27.3,127 270 top
OK5  27.3,114.3 270 top
OK6  27.3,104.14 270 top
OK7  27.3,91.44 270 top
OK8  27.3,81.28 270 top
OK9  27.3,68.58 270 top
OK10  27.3,58.42 270 top
OK11  27.3,45.72 270 top
OK12  27.3,35.56 270 top
OK13  27.3,22.86 270 top
OK14  27.3,12.7 270 top
R1  18.41,163.83 0 top
R2  27.3,156.21 0 top
R3  18.41,153.67 0 top
R4  27.3,146.05 0 top
R5  18.41,140.97 0 top
R6  27.3,133.35 0 top
R7  18.41,130.81 0 top
R8  27.3,123.19 0 top
R9  18.41,118.11 0 top
R10  27.3,110.49 0 top
R11  18.41,107.95 0 top
R12  27.3,100.33 0 top
R13  18.41,95.25 0 top
R14  27.3,87.63 0 top
R15  17.14,85.09 0 top
R16  27.3,77.47 0 top
R17  18.41,72.39 180 bottom
R18  27.3,64.77 0 top
R19  18.41,62.23 0 top
R20  27.3,54.61 0 top
R21  18.41,49.53 0 top
R22  27.3,41.91 0 top
R23  18.41,39.37 0 top
R24  27.3,31.75 0 top
R25  18.41,26.67 0 top
R26  27.3,19.05 0 top
R27  18.41,16.51 0 top
R28  27.3,8.89 0 top
R29  146.69,160.02 0 top
R30  146.69,148.59 0 top
R31  146.69,137.16 0 top
R32  146.69,125.73 0 top
R33  146.69,114.3 0 top
R34  146.69,102.87 0 top
R35  146.69,91.44 0 top
R36  146.69,81.28 0 top
R37  146.69,68.58 0 top
R38  146.69,57.15 0 top
R39  146.69,45.72 0 top
R40  146.69,34.29 0 top
R41  146.69,22.86 0 top
R42  146.69,11.43 0 top
R43  48.9,97.79 225 top
R44  102.24,52.07 0 top
RST  65.41,48.26 0 top
SL1  55.24,97.79 270 top
SL2  94.62,83.82 90 top
SL3  109.85,57.15 180 top
U$1  100.97,149.86 0 top

### Tracks (layer width: path | path; a pad name or v marks a point on that pad's centre or on a via)
GND
  Bottom 1.016: R2.1 24.77,156.21 26.04,154.94 26.04,146.05 | 26.04,146.05 R4.1 | 26.04,146.05 26.04,133.35 | 26.04,133.35 R6.1 | 26.04,133.35 26.04,123.19 | 26.04,123.19 R8.1 | 26.04,123.19 26.04,110.49 | R10.1 26.04,110.49 | 26.04,110.49 26.04,100.33 | 26.04,100.33 R12.1 | 26.04,100.33 26.04,87.63 | R14.1 26.04,87.63 | 26.04,87.63 26.04,77.47 | 26.04,77.47 R16.1 | 26.04,77.47 26.04,64.77 | 26.04,64.77 R18.1 | 26.04,64.77 26.04,54.61 | 26.04,54.61 R20.1 | 26.04,54.61 26.04,41.91 | 26.04,41.91 R22.1 | 26.04,41.91 26.04,31.75 | 26.04,31.75 R24.1 | 26.04,31.75 26.04,19.05 | 26.04,19.05 R26.1 | 26.04,19.05 26.04,8.89 R28.1
  Bottom 1.778: 73.03,41.91 73.03,39.37 38.73,5.08 26.04,5.08 26.04,8.89 | SL1.3 IC1.11 73.03,95.25 | IC6.9 103.5,72.39 103.5,100.33 | 103.5,100.33 103.5,129.54 | IC5.9 103.5,100.33 | RST.3 62.15,42.62 62.87,41.91 71.75,41.91 | 71.75,41.91 73.03,41.91 | LT.3 76.84,45.44 76.84,41.91 73.03,41.91 | 71.75,41.91 73.03,43.18 73.03,95.25 | 73.03,95.25 78.1,95.25 80.65,97.79 80.65,130.81 102.24,130.81 103.5,129.54 | OK1.2 R2.1 | OK3.2 R6.1 | OK4.2 R8.1 | OK5.2 R10.1 | OK6.2 R12.1 | OK7.2 R14.1 | OK8.2 R16.1 | OK9.2 R18.1 | OK10.2 R20.1 | OK11.2 R22.1 | R24.1 OK12.2 22.23,34.29 | OK13.2 R26.1 | OK14.2 R28.1 | OK2.2 R4.1 | 103.5,129.54 116.21,129.54 120.78,134.11 U$1.OUT-
  pour Bottom (isolate 3.81): 0,176.53 164.47,176.53 164.47,0 0,0
IN0
  Bottom 1.778: IC1.1 61.59,120.65 56.52,125.73 56.52,152.4 50.16,158.75 LED1.A OK1.3
IN1
  Bottom 1.778: IC1.2 57.79,118.11 52.7,123.19 52.7,148.59 LED2.A OK2.3
IN2
  Bottom 1.778: IC1.3 55.24,115.57 48.9,121.92 48.9,135.89 LED3.A OK3.3
IN3
  Bottom 1.778: IC1.4 52.7,113.03 45.09,120.65 45.09,125.73 LED4.A OK4.3
IN4
  Bottom 1.778: IC1.5 50.16,110.49 47.62,113.03 LED5.A OK5.3
IN5
  Bottom 1.778: IC1.6 45.09,107.95 40.01,102.87 LED6.A OK6.3
IN6
  Bottom 1.778: IC1.7 47.62,105.41 37.47,95.25 LED7.A OK7.3
IN7
  Bottom 1.778: IC1.8 49.53,102.87 41.27,94.62 41.27,85.09 37.47,81.28 LED8.A OK8.3
IN8
  Bottom 1.778: IC1.14 55.24,87.63 37.47,69.85 LED9.A OK9.3
IN9
  Bottom 1.778: IC1.15 57.79,85.09 41.27,68.58 41.27,63.5 37.47,59.69 LED10.A OK10.3
IN10
  Bottom 1.778: IC1.16 60.33,82.55 45.09,67.31 45.09,57.15 37.47,49.53 LED11.A OK11.3
IN11
  Bottom 1.778: IC1.17 62.87,80.01 50.16,67.31 50.16,48.26 37.47,35.56 LED12.A OK12.3
IN12
  Bottom 1.778: IC1.18 65.41,77.47 53.98,66.04 53.98,40.64 37.47,24.13 LED13.A OK13.3
IN13
  Bottom 1.778: IC1.19 67.94,74.93 57.79,64.77 57.79,31.75 LED14.A OK14.3
N$1  (via drill 1.02)
  other vias: 14.61,13.97
N$2
  Bottom 1.778: 12.07,163.83 R1.1
  Bottom 2.54: J2.1 12.07,163.83
N$3
  Bottom 1.778: R1.2 22.17,163.78 22.17,161.29 OK1.1
N$4  (via drill 1.02)
  Bottom 1.778: v18.41,13.97 v18.41,11.43
N$5
  Bottom 1.778: IC1.9 SL1.1 55.09,100.48 R43.1
N$6
  Bottom 1.778: LED1.K R2.2
N$7
  Bottom 1.778: 12.07,153.67 R3.1
  Bottom 2.54: J2.3 12.07,153.67
N$8
  Bottom 1.778: R3.2 22.17,153.62 22.17,151.13 OK2.1
N$10
  Bottom 1.778: LED17.A 141.6,138.43 R31.1
N$11
  Bottom 1.778: LED2.K R4.2
N$12
  Bottom 1.778: 12.07,140.97 R5.1
  Bottom 2.54: J3.1 12.07,140.97
N$13
  Bottom 1.778: R5.2 22.23,138.43 OK3.1
N$14  (via drill 1.02)
  other vias: 14.61,11.43
N$15
  Bottom 1.778: LED18.A R32.1
N$16
  Bottom 1.778: LED3.K R6.2
N$17
  Bottom 1.778: 12.07,130.81 R7.1
  Bottom 2.54: J3.3 12.07,130.81
N$18
  Bottom 1.778: R7.2 22.23,128.27 OK4.1
N$19  (via drill 1.02)
  other vias: 14.61,21.59
N$20
  Bottom 1.778: R29.1 141.6,161.29 LED15.A
N$21
  Bottom 1.778: LED4.K R8.2
N$22
  Bottom 1.778: 12.07,118.11 R9.1
  Bottom 2.54: J4.1 12.07,118.11
N$23
  Bottom 1.778: R9.2 22.17,118.06 22.17,115.57 OK5.1
N$24
  Bottom 1.778: J1.1 65.41,151.13 75.31,141.22 U$1.IN-
N$25
  Bottom 1.778: LED19.A 141.6,115.57 R33.1
N$26
  Bottom 1.778: R10.2 LED5.K
N$27
  Bottom 1.778: 12.07,107.95 R11.1
  Bottom 2.54: J4.3 12.07,107.95
N$28
  Bottom 1.778: R11.2 22.17,107.9 22.17,105.41 OK6.1
N$29  (via drill 1.02)
  Bottom 1.778: v18.41,24.13 v18.41,21.59
N$30
  Bottom 1.778: R30.1 LED16.A
N$31
  Bottom 1.778: R12.2 LED6.K
N$32
  Bottom 1.778: 12.07,95.25 R13.1
  Bottom 2.54: J7.1 12.07,95.25
N$33
  Bottom 1.778: R13.2 22.17,95.2 22.17,92.71 OK7.1
N$34  (via drill 1.02)
  other vias: 14.61,24.13
N$35
  Bottom 1.778: R34.1 140.33,105.41 LED20.A
N$36
  Bottom 1.778: R14.2 LED7.K
N$37
  Bottom 1.778: 12.07,85.09 R15.1
  Bottom 2.54: J7.3 12.07,85.09
N$38
  Bottom 1.778: R15.2 20.96,83.77 22.17,82.55 OK8.1
N$39  (via drill 1.02)
  other vias: 14.61,34.29
N$40
  Bottom 1.778: LED21.A 141.6,92.71 R35.1
N$41
  Bottom 1.778: R16.2 LED8.K
N$42
  Bottom 1.778: 12.07,72.39 R17.1
  Bottom 2.54: J6.1 12.07,72.39
N$43
  Bottom 1.778: R17.2 22.17,72.34 22.17,69.85 OK9.1
N$45
  Bottom 1.778: LED22.A 141.6,82.55 R36.1
N$46
  Bottom 1.778: LED9.K R18.2
N$47
  Bottom 1.778: 12.07,62.23 R19.1
  Bottom 2.54: J6.3 12.07,62.23
N$48
  Bottom 1.778: R19.2 22.17,62.18 22.17,59.69 OK10.1
N$49  (via drill 1.02)
  Bottom 1.778: v18.41,36.83 v18.41,34.29
N$50
  Bottom 1.778: R37.1 141.6,69.85 LED23.A
N$51
  Bottom 1.778: R20.2 LED10.K
N$52
  Bottom 1.778: 12.07,49.53 R21.1
  Bottom 2.54: J5.1 12.07,49.53
N$53
  Bottom 1.778: R21.2 22.17,49.48 22.17,46.99 OK11.1
N$54  (via drill 1.02)
  other vias: 14.61,36.83
N$55
  Bottom 1.778: R38.1 140.33,59.69 LED24.A
N$56
  Bottom 1.778: R22.2 LED11.K
N$57
  Bottom 1.778: 12.07,39.37 R23.1
  Bottom 2.54: J5.3 12.07,39.37
N$58
  Bottom 1.778: R23.2 22.17,39.32 22.17,36.83 OK12.1
N$59  (via drill 1.02)
  other vias: 14.61,44.45
N$60
  Bottom 1.778: R39.1 141.6,46.99 LED25.A
N$61
  Bottom 1.778: R24.2 LED12.K
N$62
  Bottom 1.778: 12.07,26.67 R25.1
  Bottom 2.54: J8.1 12.07,26.67
N$63
  Bottom 1.778: R25.2 22.17,26.62 22.17,24.13 OK13.1
N$65
  Bottom 1.778: R40.1 140.33,36.83 LED26.A
N$66
  Bottom 1.778: R26.2 LED13.K
N$67
  Bottom 1.778: 12.07,16.51 R27.1
  Bottom 2.54: J8.3 12.07,16.51
N$68
  Bottom 1.778: R27.2 22.17,16.46 22.17,13.97 OK14.1
N$69  (via drill 1.02)
  Bottom 1.778: v18.41,46.99 v18.41,44.45
N$70
  Bottom 1.778: R41.1 141.6,24.13 LED27.A
N$71
  Bottom 1.778: R28.2 LED14.K
N$72
  Bottom 1.778: R42.1 140.33,13.97 LED28.A
N$73
  Bottom 1.778: RST.1 62.15,65.33 67.94,71.12 68.58,71.12 68.9,71.44 68.9,72.29 | 68.9,72.29 68.95,72.34 | IC1.20 68.9,72.29
N$74
  Bottom 1.778: LT.1 77.39,65.33 84.46,72.39 IC1.21
N$75
  Bottom 1.778: K1.P 85.72,16.51 104.78,16.51 106.04,15.24 J16.2
N$76
  Bottom 1.778: K1.S 79.76,11.81 80.65,12.7 97.16,12.7 100.97,8.89 J16.1
N$77
  Bottom 1.778: R44.1 LED29.K
N$78  (via drill 1.02)
  other vias: 14.61,46.99
N$79  (via drill 1.02)
  other vias: 14.61,59.69
N$80  (via drill 1.02)
  Bottom 1.778: v18.41,59.69 v18.41,57.15
N$82  (via drill 1.02)
  other vias: 14.61,57.15
N$83  (via drill 1.02)
  other vias: 14.61,69.85
N$84  (via drill 1.02)
  Bottom 1.778: v18.41,69.85 v18.41,67.31
N$86  (via drill 1.02)
  other vias: 14.61,67.31
N$87  (via drill 1.02)
  other vias: 14.61,82.55
N$88  (via drill 1.02)
  Bottom 1.778: v18.41,82.55 v18.41,80.01
N$90  (via drill 1.02)
  other vias: 14.61,80.01
N$91  (via drill 1.02)
  other vias: 14.61,92.71
N$92  (via drill 1.02)
  Bottom 1.778: v18.41,92.71 v18.41,90.17
N$94  (via drill 1.02)
  other vias: 14.61,90.17
N$95  (via drill 1.02)
  other vias: 14.61,105.41
N$96  (via drill 1.02)
  Bottom 1.778: v18.41,105.41 v18.41,102.87
N$97  (via drill 1.02)
  other vias: 14.61,102.87
N$99  (via drill 1.02)
  other vias: 14.61,115.57
N$100  (via drill 1.02)
  Bottom 1.778: v18.41,115.57 v18.41,113.03
N$102  (via drill 1.02)
  other vias: 14.61,113.03
N$103  (via drill 1.02)
  other vias: 14.61,128.27
N$104  (via drill 1.02)
  Bottom 1.778: v18.41,128.27 v18.41,125.73
N$106  (via drill 1.02)
  other vias: 14.61,125.73
N$107  (via drill 1.02)
  other vias: 14.61,138.43
N$108  (via drill 1.02)
  Bottom 1.778: v18.41,138.43 v18.41,135.89
N$110  (via drill 1.02)
  other vias: 14.61,135.89
N$111  (via drill 1.02)
  other vias: 14.61,151.13
N$112  (via drill 1.02)
  Bottom 1.778: v18.41,151.13 v18.41,148.59
N$114  (via drill 1.02)
  other vias: 14.61,148.59
N$115  (via drill 1.02)
  other vias: 14.61,161.29
N$116  (via drill 1.02)
  Bottom 1.778: v18.41,161.29 v18.41,158.75
N$118  (via drill 1.02)
  other vias: 14.61,158.75
OUT0
  Bottom 1.778: IC1.40 IC5.1
OUT1
  Bottom 1.778: IC1.39 IC5.2
OUT2
  Bottom 1.778: IC1.38 IC5.3
OUT3
  Bottom 1.778: IC1.37 IC5.4
OUT4
  Bottom 1.778: IC1.36 IC5.5
OUT5
  Bottom 1.778: IC1.35 IC5.6
OUT6
  Bottom 1.778: IC1.34 IC5.7
OUT7
  Bottom 1.778: IC1.33 IC5.8
OUT8
  Bottom 1.778: IC6.1 IC1.29
OUT9
  Bottom 1.778: IC6.2 IC1.28
OUT10
  Bottom 1.778: IC1.27 IC6.3 SL2.4
OUT11
  Bottom 1.778: IC6.4 SL2.3 93.34,85.09 IC1.26
OUT12
  Bottom 1.778: IC6.5 SL2.2 93.98,82.55 IC1.25
OUT13
  Bottom 1.778: IC6.6 95.25,80.01 SL2.1 IC1.24
RL
  Bottom 1.778: IC6.8 IC1.22
SPK
  Bottom 1.778: IC6.7 IC1.23
ULN0
  Bottom 1.778: 153.03,160.02 R29.2 146.69,156.21 139.06,156.21 127.63,144.78 127.63,127 121.28,120.65 IC5.18
  Bottom 2.54: 153.03,160.02 J9.3
ULN1
  Bottom 1.778: 151.76,148.59 R30.2 150.5,147.32 147.95,144.78 137.79,144.78 131.44,138.43 131.44,125.73 123.82,118.11 IC5.17
  Bottom 2.54: 151.76,148.59 J9.1
ULN2
  Bottom 1.778: R31.2 146.69,133.35 139.06,133.35 133.98,128.27 133.98,123.19 126.37,115.57 IC5.16
  Bottom 2.54: R31.2 153.03,137.16 J10.3
ULN3
  Bottom 1.778: R32.2 146.69,121.92 137.79,121.92 128.91,113.03 IC5.15
  Bottom 2.54: R32.2 J10.1
ULN4
  Bottom 1.778: R33.2 146.69,110.49 IC5.14
  Bottom 2.54: J11.3 153.03,114.3 R33.2
ULN5
  Bottom 1.778: IC5.13 131.44,107.95 140.33,99.06 147.95,99.06 150.5,101.6 R34.2
  Bottom 2.54: J11.1 R34.2
ULN6
  Bottom 1.778: R35.2 147.95,88.9 139.06,88.9 136.53,91.44 136.53,97.79 128.91,105.41 IC5.12
  Bottom 2.54: J12.3 153.03,91.44 R35.2
ULN7
  Bottom 1.778: 151.76,81.28 R36.2 147.95,78.74 139.06,78.74 132.72,85.09 132.72,96.52 126.37,102.87 IC5.11
  Bottom 2.54: J12.1 153.03,81.28 151.76,81.28
ULN8
  Bottom 1.778: 151.13,68.58 R37.2 147.95,66.04 139.06,66.04 136.53,68.58 136.53,73.66 117.47,92.71 IC6.18
  Bottom 2.54: J13.3 153.03,68.58 151.13,68.58
ULN9
  Bottom 1.778: 151.13,57.15 R38.2 146.69,53.34 132.72,53.34 132.72,73.66 116.21,90.17 IC6.17
  Bottom 2.54: J13.1 151.13,57.15
ULN10
  Bottom 1.778: R39.2 147.95,43.18 133.98,43.18 128.91,48.26 128.91,73.66 114.94,87.63 IC6.16
  Bottom 2.54: J14.3 153.03,45.72 R39.2
ULN11
  Bottom 1.778: 151.13,34.29 R40.2 147.95,31.75 137.79,31.75 125.09,44.45 125.09,73.66 113.66,85.09 IC6.15
  Bottom 2.54: J14.1 151.13,34.29
ULN12
  Bottom 1.778: R41.2 147.95,20.32 137.79,20.32 121.28,36.83 121.28,73.66 112.4,82.55 IC6.14
  Bottom 2.54: J15.3 153.03,22.86 R41.2
ULN13
  Bottom 1.778: R42.2 147.95,8.89 127.63,8.89 117.47,19.05 117.47,73.88 111.34,80.01 IC6.13
  Bottom 2.54: J15.1 R42.2
ULNRL
  Bottom 1.778: IC6.11 108.7,74.93 112.4,71.24 112.4,67.31 108.59,63.5 95.88,63.5 91.69,59.31 K1.2
ULNSPK
  Bottom 1.778: IC6.12 109.76,77.47 114.94,72.29 114.94,60.96 111.12,60.96 | LED29.A 104.78,60.96 111.12,60.96 | 111.12,60.96 SL3.1
VCC
  Bottom 1.016: OK1.4 30.73,160.91 30.22,160.91 28.57,159.26 28.57,151.13 | 28.57,151.13 OK2.4 | 28.57,151.13 28.57,138.43 | 32.39,138.43 29.21,138.43 28.57,138.43 | 28.57,138.43 28.57,128.27 | 28.57,128.27 OK4.4 32.39,128.27 | 28.57,128.27 28.57,115.57 | 28.57,115.57 29.21,115.57 32.39,115.57 | 28.57,115.57 28.57,105.41 | 28.57,105.41 29.21,105.41 32.39,105.41 | 28.57,105.41 28.57,92.71 | 28.57,92.71 29.21,92.71 32.39,92.71 | 28.57,92.71 28.57,82.55 | 28.57,82.55 29.21,82.55 32.39,82.55 | 28.57,82.55 28.57,73.66 28.57,69.85 | 28.57,69.85 29.21,69.85 32.39,69.85 | 28.57,69.85 28.57,59.69 | 28.57,59.69 29.21,59.69 32.39,59.69 | 28.57,59.69 28.57,46.99 | 28.57,46.99 29.21,46.99 32.39,46.99 | 28.57,46.99 28.57,36.83 | 29.21,36.83 28.57,36.83 | 28.57,24.13 28.57,36.83 | 28.57,24.13 29.21,24.13 32.39,24.13 | 28.57,24.13 28.57,13.97 29.21,13.97 32.39,13.97
  Bottom 1.778: 28.57,73.66 29.84,74.93 38.52,74.93 41.27,77.69 41.27,80.01 51.44,90.17 51.44,95.25 | 51.44,95.25 51.44,97.79 IC1.10 | SL1.2 IC1.10 | R43.2 46.35,95.25 51.44,95.25 | OK1.4 33.66,163.83 53.98,163.83 60.33,157.48 60.33,143.51 62.87,140.97 67.94,140.97 75.56,133.35 | IC1.10 71.75,97.79 75.56,101.6 75.56,133.35 | 75.56,133.35 78.1,135.89 97.16,135.89 111.12,149.86 111.12,153.67 115.95,158.5 U$1.OUT+ | OK12.4 29.21,36.83 | OK9.4 29.21,69.85 | OK3.4 29.21,138.43 | OK5.4 29.21,115.57 | OK6.4 29.21,105.41 | OK10.4 29.21,59.69 | OK14.4 29.21,13.97 | OK7.4 29.21,92.71 | OK8.4 29.21,82.55 | OK13.4 29.21,24.13 | OK11.4 29.21,46.99
VIN
  Bottom 1.778: LED15.K 152.4,163.83 J9.4 156.84,163.83 158.11,162.56 | LED16.K 140.33,152.4 153.03,152.4 | LED19.K 152.4,118.11 J11.4 158.11,118.11 | LED20.K 152.4,107.95 J11.2 155.57,107.95 158.11,107.95 | LED21.K 153.03,95.25 J12.4 156.21,95.25 158.11,95.25 | LED22.K 153.03,85.09 J12.2 155.57,85.09 158.11,85.09 | LED23.K 153.03,72.39 J13.4 156.21,72.39 158.11,72.39 | LED24.K 153.03,62.23 J13.2 155.57,62.23 158.11,62.23 | LED25.K 153.03,49.53 J14.4 156.21,49.53 158.11,49.53 | LED26.K 153.03,39.37 J14.2 156.21,39.37 158.11,39.37 | LED27.K 153.03,26.67 J15.4 155.57,26.67 156.84,26.67 158.11,25.4 | LED28.K 153.03,16.51 | LED17.K 152.4,140.97 J10.4 156.84,140.97 158.11,140.97 | LED18.K 140.33,129.54 153.03,129.54 | 158.11,162.56 158.11,153.67 | 158.11,153.67 158.11,140.97 | 158.11,140.97 158.11,130.81 | 158.11,130.81 158.11,118.11 | 158.11,118.11 158.11,107.95 | 158.11,107.95 158.11,95.25 | 158.11,95.25 158.11,85.09 | 158.11,85.09 158.11,76.2 | 158.11,76.2 158.11,72.39 | 158.11,72.39 158.11,62.23 | 158.11,62.23 158.11,49.53 | 158.11,49.53 158.11,39.37 | 158.11,39.37 158.11,25.4 | 158.11,25.4 158.11,19.05 | 155.57,16.51 158.11,19.05 | 158.11,153.67 156.84,153.67 | 158.11,130.81 156.84,130.81 | IC5.10 117.47,100.33 130.18,87.63 130.18,83.82 137.79,76.2 158.11,76.2 | IC6.10 102.24,67.31 92.07,67.31 87,62.23 87,30.48 83.19,26.67 80.65,26.67 79.38,25.4 79.38,20.96 | 79.38,20.96 79.38,19.05 | 123.82,3.81 107.64,3.81 107.26,3.42 99.75,3.42 99.37,3.81 74.29,3.81 74.29,14.73 K1.1 79.38,20.96 | 123.82,3.81 155.57,3.81 158.11,6.35 158.11,19.05 | SL3.2 108.59,52.07 | 108.59,52.07 108.59,19.05 123.82,3.81 | R44.2 108.59,52.07
  Bottom 1.778: 5.71,158.75 5.71,171.45 69.22,171.45 70.49,170.18 J1.2 75.56,161.29 75.56,158.75 75.82,158.5 U$1.IN+ 91.57,168.91 158.11,168.91 158.11,163.83 158.11,162.56 | 5.71,158.75 5.71,148.59 | 5.71,148.59 5.71,135.89 | 5.71,135.89 5.71,125.73 | 5.71,125.73 5.71,113.03 5.71,102.87 | 5.71,102.87 5.71,90.17 | 5.71,90.17 5.71,80.01 | 5.71,80.01 5.71,67.31 | 5.71,67.31 5.71,57.15 | 5.71,57.15 5.71,44.45 5.71,34.29 5.71,21.59 5.71,11.43 | 6.99,158.75 5.71,158.75 | 6.99,135.89 5.71,135.89 | 6.99,67.31 5.71,67.31 | 6.99,80.01 5.71,80.01 | 6.99,90.17 5.71,90.17 | 6.99,148.59 5.71,148.59 | 6.99,57.15 5.71,57.15 | 6.99,102.87 5.71,102.87 | 6.99,125.73 5.71,125.73
  Bottom 2.54: J8.4 5.71,11.43 | J8.2 5.71,21.59 | J5.4 5.71,34.29 | J5.2 5.71,44.45 | J6.4 6.99,57.15 | J6.2 6.99,67.31 | J7.4 6.99,80.01 | J7.2 6.99,90.17 | J4.4 6.99,102.87 | J4.2 5.71,113.03 | J3.4 6.99,125.73 | J3.2 6.99,135.89 | J2.4 6.99,148.59 | J2.2 6.99,158.75 | 158.11,163.83 152.4,163.83 | 156.84,153.67 J9.2 153.03,152.4 | 156.84,140.97 152.4,140.97 | 156.84,130.81 J10.2 153.03,129.54 | 158.11,118.11 152.4,118.11 | 152.4,107.95 155.57,107.95 | 156.21,95.25 153.03,95.25 | 153.03,85.09 155.57,85.09 | 156.21,72.39 153.03,72.39 | 155.57,62.23 153.03,62.23 | 156.21,49.53 153.03,49.53 | 156.21,39.37 153.03,39.37 | 155.57,26.67 153.03,26.67 | 153.03,16.51 J15.2 155.57,16.51